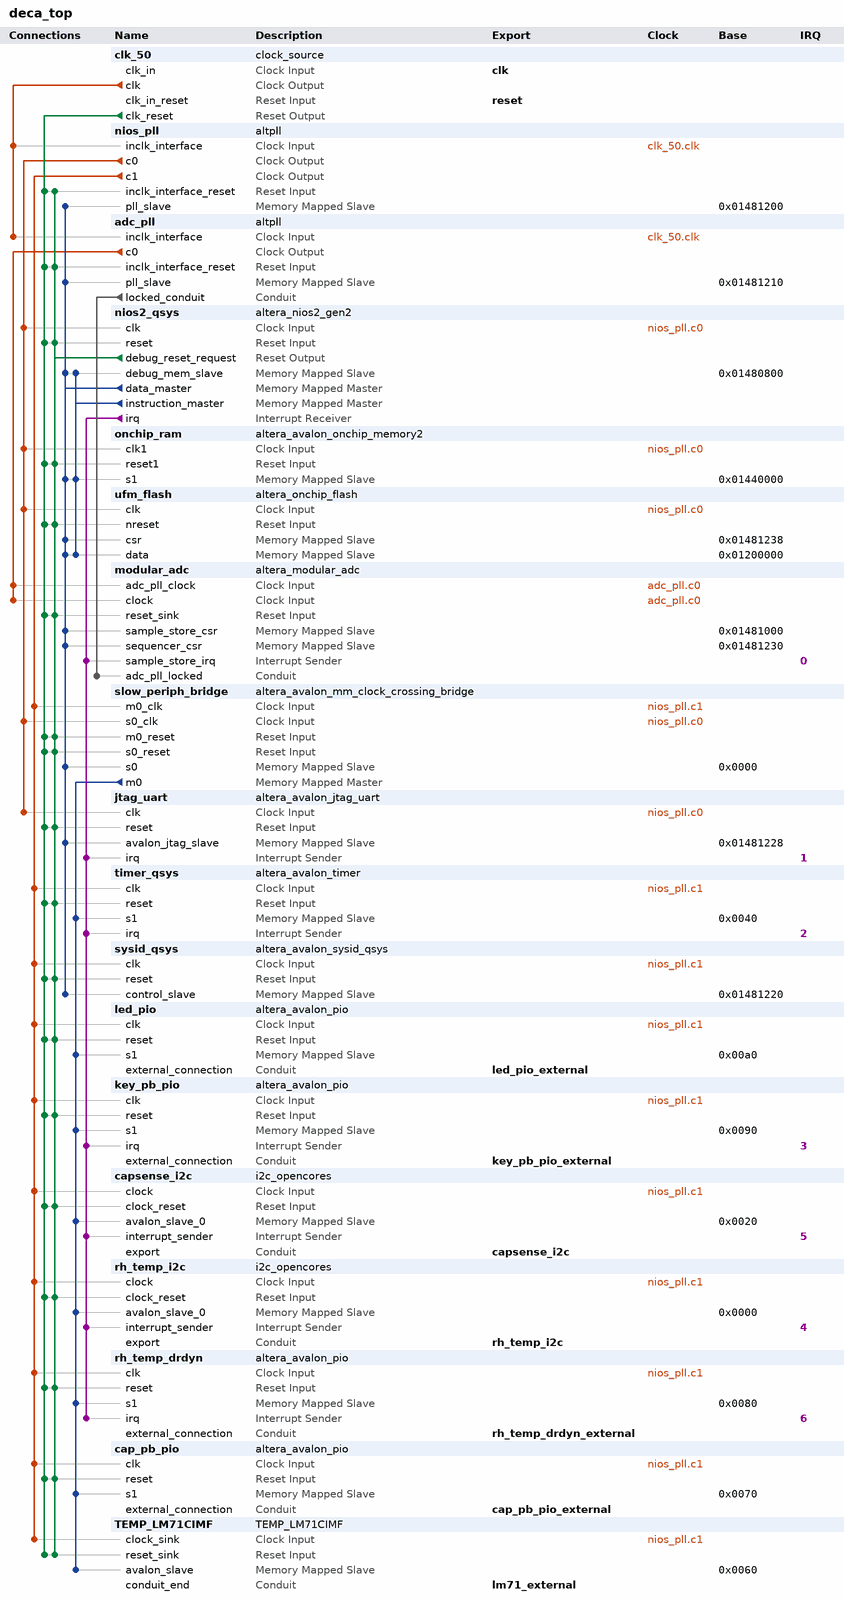
[diagram p0: system contents]
# Platform Designer (Qsys) system deca_top, MAX 10 10M50DAF484C6GES
# Parameters at their usual value, and those the tool derives, are not listed.
package require -exact qsys 15.0
create_system deca_top
set_project_property DEVICE_FAMILY {MAX 10}
set_project_property DEVICE 10M50DAF484C6GES

add_instance clk_50 clock_source 15.0
set_instance_parameter_value clk_50 clockFrequency 50000000

add_instance nios_pll altpll 15.0
set_instance_parameter_value nios_pll CLK0_DIVIDE_BY 5
set_instance_parameter_value nios_pll CLK0_MULTIPLY_BY 8
set_instance_parameter_value nios_pll CLK1_DIVIDE_BY 5
set_instance_parameter_value nios_pll CLK1_DUTY_CYCLE 50
set_instance_parameter_value nios_pll CLK1_MULTIPLY_BY 4
set_instance_parameter_value nios_pll CLK1_PHASE_SHIFT 0
set_instance_parameter_value nios_pll INCLK0_INPUT_FREQUENCY 20000
set_instance_parameter_value nios_pll PORT_ARESET PORT_UNUSED
set_instance_parameter_value nios_pll PORT_LOCKED PORT_UNUSED
set_instance_parameter_value nios_pll PORT_clk1 PORT_USED
set_instance_parameter_value nios_pll PORT_clk2 PORT_UNUSED
set_instance_parameter_value nios_pll PORT_clk3 PORT_UNUSED

add_instance adc_pll altpll 15.0
set_instance_parameter_value adc_pll CLK0_DIVIDE_BY 5
set_instance_parameter_value adc_pll CLK0_MULTIPLY_BY 1
set_instance_parameter_value adc_pll INCLK0_INPUT_FREQUENCY 20000
set_instance_parameter_value adc_pll PORT_ARESET PORT_UNUSED
set_instance_parameter_value adc_pll PORT_LOCKED PORT_USED
set_instance_parameter_value adc_pll PORT_clk1 PORT_UNUSED
set_instance_parameter_value adc_pll PORT_clk2 PORT_UNUSED
set_instance_parameter_value adc_pll PORT_clk3 PORT_UNUSED

add_instance nios2_qsys altera_nios2_gen2 15.0
set_instance_parameter_value nios2_qsys dcache_size 2048
set_instance_parameter_value nios2_qsys exceptionSlave onchip_ram.s1
set_instance_parameter_value nios2_qsys icache_size 4096
set_instance_parameter_value nios2_qsys impl Tiny
set_instance_parameter_value nios2_qsys resetSlave onchip_ram.s1

add_instance onchip_ram altera_avalon_onchip_memory2 15.0
set_instance_parameter_value onchip_ram dataWidth 32
set_instance_parameter_value onchip_ram dualPort false
set_instance_parameter_value onchip_ram initMemContent true
set_instance_parameter_value onchip_ram initializationFileName onchip_mem.hex
set_instance_parameter_value onchip_ram memorySize 153600

add_instance ufm_flash altera_onchip_flash 15.0
set_instance_parameter_value ufm_flash CONFIGURATION_MODE {Single Uncompressed Image with Memory Initialization}
set_instance_parameter_value ufm_flash SECTOR_ACCESS_MODE {Read and write,Read and write,Read and write,Read and write,Read and write}
set_instance_parameter_value ufm_flash initFlashContent false
set_instance_parameter_value ufm_flash initializationFileName altera_onchip_flash.hex
set_instance_parameter_value ufm_flash useNonDefaultInitFile false

add_instance modular_adc altera_modular_adc 15.0
set_instance_parameter_value modular_adc CLOCK_FREQ 10000000
set_instance_parameter_value modular_adc CORE_VAR 0
set_instance_parameter_value modular_adc DEVICE_PART 10M50DAF484C6GES
set_instance_parameter_value modular_adc clkdiv 2
set_instance_parameter_value modular_adc int_vref_vr 3.0
set_instance_parameter_value modular_adc refsel 0
set_instance_parameter_value modular_adc seq_order_length 5
set_instance_parameter_value modular_adc seq_order_slot_1 0
set_instance_parameter_value modular_adc seq_order_slot_2 1
set_instance_parameter_value modular_adc seq_order_slot_3 2
set_instance_parameter_value modular_adc seq_order_slot_4 3
set_instance_parameter_value modular_adc seq_order_slot_5 5
set_instance_parameter_value modular_adc seq_order_slot_6 30
set_instance_parameter_value modular_adc seq_order_slot_7 30
set_instance_parameter_value modular_adc tsclkdiv 1
set_instance_parameter_value modular_adc use_ch0 true
set_instance_parameter_value modular_adc use_ch2 true
set_instance_parameter_value modular_adc use_ch3 true
set_instance_parameter_value modular_adc use_ch4 false
set_instance_parameter_value modular_adc use_ch5 true
set_instance_parameter_value modular_adc use_ch6 false
set_instance_parameter_value modular_adc use_ch7 false
set_instance_parameter_value modular_adc use_ch8 false
set_instance_parameter_value modular_adc use_tsd false

add_instance slow_periph_bridge altera_avalon_mm_clock_crossing_bridge 15.0
set_instance_parameter_value slow_periph_bridge ADDRESS_UNITS WORDS
set_instance_parameter_value slow_periph_bridge ADDRESS_WIDTH 10
set_instance_parameter_value slow_periph_bridge COMMAND_FIFO_DEPTH 8
set_instance_parameter_value slow_periph_bridge DATA_WIDTH 32
set_instance_parameter_value slow_periph_bridge MASTER_SYNC_DEPTH 2
set_instance_parameter_value slow_periph_bridge MAX_BURST_SIZE 1
set_instance_parameter_value slow_periph_bridge RESPONSE_FIFO_DEPTH 32
set_instance_parameter_value slow_periph_bridge SLAVE_SYNC_DEPTH 2
set_instance_parameter_value slow_periph_bridge USE_AUTO_ADDRESS_WIDTH 0

add_instance jtag_uart altera_avalon_jtag_uart 15.0
set_instance_parameter_value jtag_uart simInteractiveOptions NO_INTERACTIVE_WINDOWS

add_instance timer_qsys altera_avalon_timer 15.0
set_instance_parameter_value timer_qsys period 1
set_instance_parameter_value timer_qsys periodUnits MSEC

add_instance sysid_qsys altera_avalon_sysid_qsys 15.0
set_instance_parameter_value sysid_qsys id 57034

add_instance led_pio altera_avalon_pio 15.0
set_instance_parameter_value led_pio direction Output
set_instance_parameter_value led_pio width 8

add_instance key_pb_pio altera_avalon_pio 15.0
set_instance_parameter_value key_pb_pio bitClearingEdgeCapReg true
set_instance_parameter_value key_pb_pio captureEdge true
set_instance_parameter_value key_pb_pio direction Input
set_instance_parameter_value key_pb_pio generateIRQ true
set_instance_parameter_value key_pb_pio irqType EDGE
set_instance_parameter_value key_pb_pio simDoTestBenchWiring true
set_instance_parameter_value key_pb_pio width 1

add_instance capsense_i2c i2c_opencores 13.0

add_instance rh_temp_i2c i2c_opencores 13.0

add_instance rh_temp_drdyn altera_avalon_pio 15.0
set_instance_parameter_value rh_temp_drdyn captureEdge true
set_instance_parameter_value rh_temp_drdyn direction Input
set_instance_parameter_value rh_temp_drdyn edgeType FALLING
set_instance_parameter_value rh_temp_drdyn generateIRQ true
set_instance_parameter_value rh_temp_drdyn irqType EDGE
set_instance_parameter_value rh_temp_drdyn width 1

add_instance cap_pb_pio altera_avalon_pio 15.0
set_instance_parameter_value cap_pb_pio direction Output
set_instance_parameter_value cap_pb_pio width 2

add_instance TEMP_LM71CIMF TEMP_LM71CIMF 1.0

# connections
add_connection adc_pll.c0 modular_adc.adc_pll_clock clock
add_connection adc_pll.c0 modular_adc.clock clock
add_connection clk_50.clk adc_pll.inclk_interface clock
add_connection clk_50.clk nios_pll.inclk_interface clock
add_connection nios_pll.c0 jtag_uart.clk clock
add_connection nios_pll.c0 nios2_qsys.clk clock
add_connection nios_pll.c0 onchip_ram.clk1 clock
add_connection nios_pll.c0 slow_periph_bridge.s0_clk clock
add_connection nios_pll.c0 ufm_flash.clk clock
add_connection nios_pll.c1 cap_pb_pio.clk clock
add_connection nios_pll.c1 capsense_i2c.clock clock
add_connection nios_pll.c1 key_pb_pio.clk clock
add_connection nios_pll.c1 led_pio.clk clock
add_connection nios_pll.c1 rh_temp_drdyn.clk clock
add_connection nios_pll.c1 rh_temp_i2c.clock clock
add_connection nios_pll.c1 slow_periph_bridge.m0_clk clock
add_connection nios_pll.c1 sysid_qsys.clk clock
add_connection nios_pll.c1 TEMP_LM71CIMF.clock_sink clock
add_connection nios_pll.c1 timer_qsys.clk clock
add_connection clk_50.clk_reset adc_pll.inclk_interface_reset reset
add_connection clk_50.clk_reset cap_pb_pio.reset reset
add_connection clk_50.clk_reset capsense_i2c.clock_reset reset
add_connection clk_50.clk_reset jtag_uart.reset reset
add_connection clk_50.clk_reset key_pb_pio.reset reset
add_connection clk_50.clk_reset led_pio.reset reset
add_connection clk_50.clk_reset modular_adc.reset_sink reset
add_connection clk_50.clk_reset nios2_qsys.reset reset
add_connection clk_50.clk_reset nios_pll.inclk_interface_reset reset
add_connection clk_50.clk_reset onchip_ram.reset1 reset
add_connection clk_50.clk_reset rh_temp_drdyn.reset reset
add_connection clk_50.clk_reset rh_temp_i2c.clock_reset reset
add_connection clk_50.clk_reset slow_periph_bridge.m0_reset reset
add_connection clk_50.clk_reset slow_periph_bridge.s0_reset reset
add_connection clk_50.clk_reset sysid_qsys.reset reset
add_connection clk_50.clk_reset TEMP_LM71CIMF.reset_sink reset
add_connection clk_50.clk_reset timer_qsys.reset reset
add_connection clk_50.clk_reset ufm_flash.nreset reset
add_connection nios2_qsys.debug_reset_request adc_pll.inclk_interface_reset reset
add_connection nios2_qsys.debug_reset_request cap_pb_pio.reset reset
add_connection nios2_qsys.debug_reset_request capsense_i2c.clock_reset reset
add_connection nios2_qsys.debug_reset_request jtag_uart.reset reset
add_connection nios2_qsys.debug_reset_request key_pb_pio.reset reset
add_connection nios2_qsys.debug_reset_request led_pio.reset reset
add_connection nios2_qsys.debug_reset_request modular_adc.reset_sink reset
add_connection nios2_qsys.debug_reset_request nios2_qsys.reset reset
add_connection nios2_qsys.debug_reset_request nios_pll.inclk_interface_reset reset
add_connection nios2_qsys.debug_reset_request onchip_ram.reset1 reset
add_connection nios2_qsys.debug_reset_request rh_temp_drdyn.reset reset
add_connection nios2_qsys.debug_reset_request rh_temp_i2c.clock_reset reset
add_connection nios2_qsys.debug_reset_request slow_periph_bridge.m0_reset reset
add_connection nios2_qsys.debug_reset_request slow_periph_bridge.s0_reset reset
add_connection nios2_qsys.debug_reset_request sysid_qsys.reset reset
add_connection nios2_qsys.debug_reset_request TEMP_LM71CIMF.reset_sink reset
add_connection nios2_qsys.debug_reset_request timer_qsys.reset reset
add_connection nios2_qsys.debug_reset_request ufm_flash.nreset reset
add_connection nios2_qsys.data_master adc_pll.pll_slave avalon
set_connection_parameter_value nios2_qsys.data_master/adc_pll.pll_slave baseAddress 0x01481210
add_connection nios2_qsys.data_master jtag_uart.avalon_jtag_slave avalon
set_connection_parameter_value nios2_qsys.data_master/jtag_uart.avalon_jtag_slave baseAddress 0x01481228
add_connection nios2_qsys.data_master modular_adc.sample_store_csr avalon
set_connection_parameter_value nios2_qsys.data_master/modular_adc.sample_store_csr baseAddress 0x01481000
add_connection nios2_qsys.data_master modular_adc.sequencer_csr avalon
set_connection_parameter_value nios2_qsys.data_master/modular_adc.sequencer_csr baseAddress 0x01481230
add_connection nios2_qsys.data_master nios2_qsys.debug_mem_slave avalon
set_connection_parameter_value nios2_qsys.data_master/nios2_qsys.debug_mem_slave baseAddress 0x01480800
add_connection nios2_qsys.data_master nios_pll.pll_slave avalon
set_connection_parameter_value nios2_qsys.data_master/nios_pll.pll_slave baseAddress 0x01481200
add_connection nios2_qsys.data_master onchip_ram.s1 avalon
set_connection_parameter_value nios2_qsys.data_master/onchip_ram.s1 baseAddress 0x01440000
add_connection nios2_qsys.data_master slow_periph_bridge.s0 avalon
set_connection_parameter_value nios2_qsys.data_master/slow_periph_bridge.s0 baseAddress 0x0000
add_connection nios2_qsys.data_master sysid_qsys.control_slave avalon
set_connection_parameter_value nios2_qsys.data_master/sysid_qsys.control_slave baseAddress 0x01481220
add_connection nios2_qsys.data_master ufm_flash.csr avalon
set_connection_parameter_value nios2_qsys.data_master/ufm_flash.csr baseAddress 0x01481238
add_connection nios2_qsys.data_master ufm_flash.data avalon
set_connection_parameter_value nios2_qsys.data_master/ufm_flash.data baseAddress 0x01200000
add_connection nios2_qsys.instruction_master nios2_qsys.debug_mem_slave avalon
set_connection_parameter_value nios2_qsys.instruction_master/nios2_qsys.debug_mem_slave baseAddress 0x01480800
add_connection nios2_qsys.instruction_master onchip_ram.s1 avalon
set_connection_parameter_value nios2_qsys.instruction_master/onchip_ram.s1 baseAddress 0x01440000
add_connection nios2_qsys.instruction_master ufm_flash.data avalon
set_connection_parameter_value nios2_qsys.instruction_master/ufm_flash.data baseAddress 0x01200000
add_connection slow_periph_bridge.m0 cap_pb_pio.s1 avalon
set_connection_parameter_value slow_periph_bridge.m0/cap_pb_pio.s1 baseAddress 0x0070
add_connection slow_periph_bridge.m0 capsense_i2c.avalon_slave_0 avalon
set_connection_parameter_value slow_periph_bridge.m0/capsense_i2c.avalon_slave_0 baseAddress 0x0020
add_connection slow_periph_bridge.m0 key_pb_pio.s1 avalon
set_connection_parameter_value slow_periph_bridge.m0/key_pb_pio.s1 baseAddress 0x0090
add_connection slow_periph_bridge.m0 led_pio.s1 avalon
set_connection_parameter_value slow_periph_bridge.m0/led_pio.s1 baseAddress 0x00a0
add_connection slow_periph_bridge.m0 rh_temp_drdyn.s1 avalon
set_connection_parameter_value slow_periph_bridge.m0/rh_temp_drdyn.s1 baseAddress 0x0080
add_connection slow_periph_bridge.m0 rh_temp_i2c.avalon_slave_0 avalon
set_connection_parameter_value slow_periph_bridge.m0/rh_temp_i2c.avalon_slave_0 baseAddress 0x0000
add_connection slow_periph_bridge.m0 TEMP_LM71CIMF.avalon_slave avalon
set_connection_parameter_value slow_periph_bridge.m0/TEMP_LM71CIMF.avalon_slave baseAddress 0x0060
add_connection slow_periph_bridge.m0 timer_qsys.s1 avalon
set_connection_parameter_value slow_periph_bridge.m0/timer_qsys.s1 baseAddress 0x0040
add_connection adc_pll.locked_conduit modular_adc.adc_pll_locked conduit
add_connection nios2_qsys.irq capsense_i2c.interrupt_sender interrupt
set_connection_parameter_value nios2_qsys.irq/capsense_i2c.interrupt_sender irqNumber 5
add_connection nios2_qsys.irq jtag_uart.irq interrupt
set_connection_parameter_value nios2_qsys.irq/jtag_uart.irq irqNumber 1
add_connection nios2_qsys.irq key_pb_pio.irq interrupt
set_connection_parameter_value nios2_qsys.irq/key_pb_pio.irq irqNumber 3
add_connection nios2_qsys.irq modular_adc.sample_store_irq interrupt
set_connection_parameter_value nios2_qsys.irq/modular_adc.sample_store_irq irqNumber 0
add_connection nios2_qsys.irq rh_temp_drdyn.irq interrupt
set_connection_parameter_value nios2_qsys.irq/rh_temp_drdyn.irq irqNumber 6
add_connection nios2_qsys.irq rh_temp_i2c.interrupt_sender interrupt
set_connection_parameter_value nios2_qsys.irq/rh_temp_i2c.interrupt_sender irqNumber 4
add_connection nios2_qsys.irq timer_qsys.irq interrupt
set_connection_parameter_value nios2_qsys.irq/timer_qsys.irq irqNumber 2

# exported interfaces
add_interface cap_pb_pio_external conduit end
set_interface_property cap_pb_pio_external EXPORT_OF cap_pb_pio.external_connection
add_interface capsense_i2c conduit end
set_interface_property capsense_i2c EXPORT_OF capsense_i2c.export
add_interface clk clock sink
set_interface_property clk EXPORT_OF clk_50.clk_in
add_interface key_pb_pio_external conduit end
set_interface_property key_pb_pio_external EXPORT_OF key_pb_pio.external_connection
add_interface led_pio_external conduit end
set_interface_property led_pio_external EXPORT_OF led_pio.external_connection
add_interface lm71_external conduit end
set_interface_property lm71_external EXPORT_OF TEMP_LM71CIMF.conduit_end
add_interface reset reset sink
set_interface_property reset EXPORT_OF clk_50.clk_in_reset
add_interface rh_temp_drdyn_external conduit end
set_interface_property rh_temp_drdyn_external EXPORT_OF rh_temp_drdyn.external_connection
add_interface rh_temp_i2c conduit end
set_interface_property rh_temp_i2c EXPORT_OF rh_temp_i2c.export

set_interconnect_requirement {$system} qsys_mm.clockCrossingAdapter HANDSHAKE
set_interconnect_requirement {$system} qsys_mm.enableEccProtection FALSE
set_interconnect_requirement {$system} qsys_mm.insertDefaultSlave FALSE
set_interconnect_requirement {$system} qsys_mm.maxAdditionalLatency 1

save_system deca_top.qsys
